# Altium schematic sheet supply.SchDoc: supply
size A4; SheetNumber: 1; SheetTotal: 1
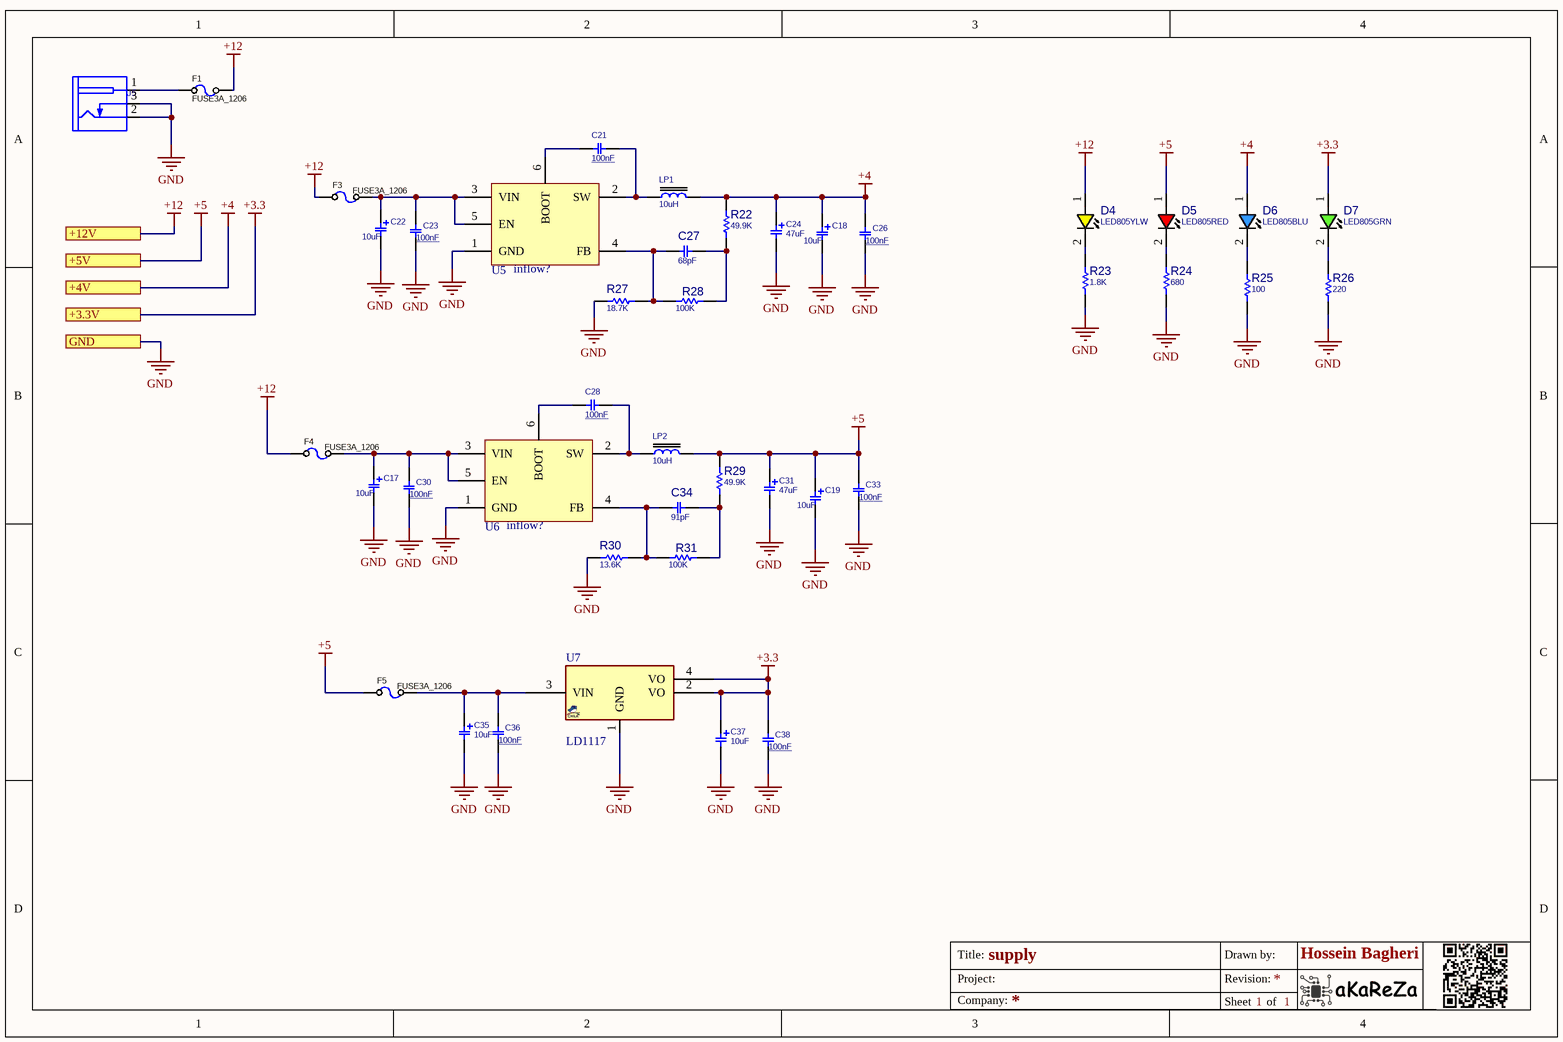
[diagram p0: supply.SchDoc]

## Parts
C17  10uF  [C_TN_3528]
C18  10uF  [C_TN_3528]
C19  10uF  [C_TN_3528]
C21  100nF  [C1206]
C22  10uF  [C_TN_3528]
C23  100nF  [C1206]
C24  47uF  [C_TN_2012]
C26  100nF  [C1206]
C27  68pF  [C0805]
C28  100nF  [C1206]
C30  100nF  [C1206]
C31  47uF  [C_TN_2012]
C33  100nF  [C1206]
C34  91pF  [C0805]
C35  10uF  [C_TN_2012]
C36  100nF  [C1206]
C37  10uF  [C_TN_2012]
C38  100nF  [C1206]
D4  LED805YLW  [LED0805YLW]
D5  LED805RED  [LED0805RED]
D6  LED805BLU  [LED0805BLU]
D7  LED805GRN  [LED0805GRN]
F1  FUSE3A_1206  [F1206]
F3  FUSE3A_1206  [F1206]
F4  FUSE3A_1206  [F1206]
F5  FUSE3A_1206  [F1206]
J5  DC_POWER_JACK  [JAC_PWR2]  (value not drawn)
LP1  10uH  [L_7]
LP2  10uH  [L_7]
R22  49.9K  [R0805]
R23  1.8K  [R0805]
R24  680  [R0805]
R25  100  [R0805]
R26  220  [R0805]
R27  18.7K  [R0805]
R28  100K  [R0805]
R29  49.9K  [R0805]
R30  13.6K  [R0805]
R31  100K  [R0805]
U5  Inflow: inflow?  [TPS54302]  (hidden comment: Value?)
U6  Inflow: inflow?  [TPS54302]  (hidden comment: Value?)
U7  LD1117  [SOT223_4]

## Ports
+3.3V, +4V, +5V, +12V, GND

## Nets
+3.3: C37.1 C38.2 D7.1(ANODE) U7.2(VO) U7.4(VO) ; port +3.3V
+4: C18.1 C24.1 C26.2 D6.1(ANODE) LP1.2 R22.2 ; port +4V
+5: C19.1 C31.1 C33.2 D5.1(ANODE) F5.1 LP2.2 R29.2 ; port +5V
+12: D4.1(ANODE) F1.2 F3.1 F4.1 ; port +12V
GND: C17.2 C18.2 C19.2 C22.2 C23.1 C24.2 C26.1 C30.1 C31.2 C33.1 C35.2 C36.1 C37.2 C38.1 J5.2(SLEEVE) J5.3(INSERTION_DET) R23.1 R24.1 R25.1 R26.1 R27.1 R30.1 U5.1(GND) U6.1(GND) U7.1(GND) ; port GND
NetC17_1: C17.1 C30.2 F4.2 U6.3(VIN) U6.5(EN)
NetC21_1: C21.1 LP1.1 U5.2(SW)
NetC21_2: C21.2 U5.6(BOOT)
NetC22_1: C22.1 C23.2 F3.2 U5.3(VIN) U5.5(EN)
NetC27_1: C27.1 R27.2 R28.1 U5.4(FB)
NetC27_2: C27.2 R22.1 R28.2
NetC28_1: C28.1 LP2.1 U6.2(SW)
NetC28_2: C28.2 U6.6(BOOT)
NetC34_1: C34.1 R30.2 R31.1 U6.4(FB)
NetC34_2: C34.2 R29.1 R31.2
NetC35_1: C35.1 C36.2 F5.2 U7.3(VIN)
NetD4_2: D4.2(CATHODE) R23.2
NetD5_2: D5.2(CATHODE) R24.2
NetD6_2: D6.2(CATHODE) R25.2
NetD7_2: D7.2(CATHODE) R26.2
NetF1_1: F1.1 J5.1(TIP)

## Notes on the sheet
- Title:
- Project:
- Drawn by:
- Revision:
- Hossein Bagheri
- Company:
- Sheet
- of

## Library data of the parts
C17-C19 C22 = CAP_SMD_TAN_10uF_16V: CAP, SMD, TAN; PARAM: 20%, 200mOhm, -55~105oC; MANF: AVX; MANF_P#: TCJT106M016R0200; PARAM2: 25V; PRICE: 1$; VALUE: 10uF
C21 C23 C26 C28 C30 C33 C36 C38 = CAP_SMD_MLCC_1206: CAP, MLCC, -F, -V, MATERIAL, -%, 0201; PARAM: -, -%; MANF_P#: MANF_PART#; PRICE: 100= 1$; MANF: -; PARAM2: -V; ASSEMBLY: ASSEMBLY; VALUE: 100nF
C24 C31 C35 C37 = CAP_SMD_TAN: CAP, SMD, TAN,; PARAM2: 6.3V
  C24 C31: VALUE: 47uF
  C35 C37: VALUE: 10uF
C27 C34 = CAP_SMD_MLCC_2.2u50V_0805: CAP, MLCC; MANF_P#: UMK212ABJ225KG-T; MANF: Taiyo Yuden; PARAM: X5R, 10%; DIST#: MOUSER; PARAM2: 50V; ASSEMBLY: ASSEMBLY; PRICE: 100= 10$; DESC: CAP, MLCC
  C27: VALUE: 68pF
  C34: VALUE: 91pF
D4 = LED_SMD_0805_YLW: LED, SMD, 0805, YELLOW; DESC: DESCRIPTION; MANF_P#: MANF_PART#; PARAM2: 2.2V; MANF: MANF; ASSEMBLY: ASSEMBLY; PRICE: 36t@Javan; VALUE: LED805YLW
D5 = LED_SMD_0805_RED: LED, SMD, 0805, RED; DESC: DESCRIPTION; MANF_P#: MANF_PART#; PARAM2: 2.2V; MANF: MANF; ASSEMBLY: ASSEMBLY; PRICE: 36t@Javan; VALUE: LED805RED
D6 = LED_SMD_0805_BLU: LED, SMD, 0805, BLUE; DESC: DESCRIPTION; MANF_P#: MANF_PART#; PARAM2: 2.2V; MANF: MANF; ASSEMBLY: ASSEMBLY; PRICE: 36t@Javan; VALUE: LED805BLU
D7 = LED_SMD_0805_GRN: LED, SMD, 0805, GREEN; PARAM: 20mA; DESC: DESCRIPTION; PARAM2: 2.2V; MANF: -; ASSEMBLY: ASSEMBLY; PRICE: 36t@Javan; MANF_P#: -; VALUE: LED805GRN
F1 F3-F5 = FUSE_3A_1206_SLOW: Fuse, 3A, 32VDC, 1206, SMD, Slow Blow; PARAM: 3A; 32VDC; Slow Blow; MANF: Bourns; MANF_P#: SF-1206SP300-2; PARAM2: 0.027Ohm; PRICE: 0.9$; VALUE: FUSE3A_1206
J5 = CONN_PWR_JACKR2: CONN, PWR JACK DC, PLUG DIAM 2.0MM RA THD; MANF: CUI STACK; MANF_P#: PJ-202A, PJ-002AH, PJ-102AH, KLDX-0202; VALUE: DC_POWER_JACK
LP1 = IND_SMD_3.3uH_8A: INDUCTOR, 10uH, 8A (Irms), 10mOhm; PARAM: 8A (Irms), 12A Isat; DESC: INDUCTOR, 3.3uH, 8A (Irms), 10mOhm; MANF: Bourns; MANF_P#: SRP7050TA-3R3M; PRICE: 1.3$; PARAM2: 10mOhm; ASSEMBLY: ASSEMBLY; VALUE: 10uH
LP2 = IND_SMD_3.3uH_8A: INDUCTOR, 10uH, 8A (Irms), 10mOhm; PARAM: 3A (Irms), 3.5 Isat; DESC: INDUCTOR, 3.3uH, 8A (Irms), 10mOhm; MANF: Bourns; MANF_P#: SRP7050TA-3R3M; PRICE: 1.3$; PARAM2: 10mOhm; ASSEMBLY: ASSEMBLY; VALUE: 10uH
R22-R31 = RES_SMD_0805: RESISTOR, SMD; PARAM: -W; DESC: DESCRIPTION; DIST#: MOUSER; PARAM2: 1%; MANF_P#: -; MANF: -; ASSEMBLY: ASSEMBLY; PRICE: 100= 0.5$
  R22 R29: VALUE: 49.9K
  R23: VALUE: 1.8K
  R24: VALUE: 680
  R25: VALUE: 100
  R26: VALUE: 220
  R27: VALUE: 18.7K
  R28 R31: VALUE: 100K
  R30: VALUE: 13.6K
U5 U6 = IC_Reg_TPS54302: 3'A Synchronous Step-Down Converter; Rating: S; Validation: Valid; Value: Value?; Type: Switching; Package: SOT-23-6
U7 = VREG_1117_SOT223: REG, Linear, LDO1V, 0.8A, SOT-223; MANF_P#: LD1117, LM1117, AMS1117, TLV1117, REG1117, NCP1117, LT1117, SPX1117; MANF: TI, ON, ST; PARAM2: 1.2/1.5/1.8/2.5/2.85/3.3/5V; PARAM: LDO1V, 0.8A; VALUE: LD1117